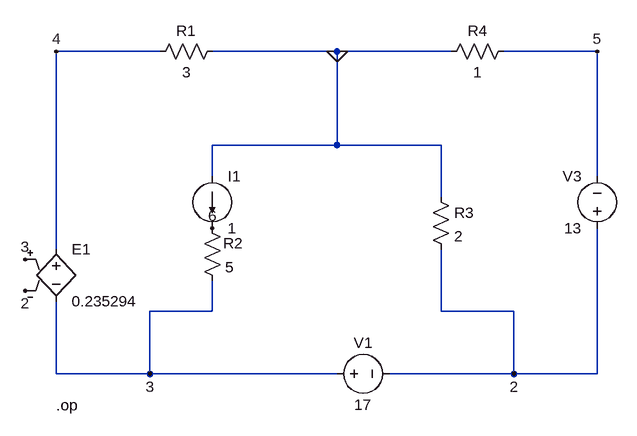
[diagram p0: schematic surse_comandate.asc]
surse_comandate.asc, the LTspice schematic file:
Version 4
SHEET 1 1016 680
WIRE -16 -176 -176 -176
WIRE 256 -176 64 -176
WIRE 432 -176 256 -176
WIRE 656 -176 512 -176
WIRE 256 -32 256 -176
WIRE 256 -32 64 -32
WIRE 416 -32 256 -32
WIRE 64 16 64 -32
WIRE 656 16 656 -176
WIRE 416 48 416 -32
WIRE -176 128 -176 -176
WIRE 64 224 64 176
WIRE 64 224 -32 224
WIRE 416 224 416 128
WIRE 528 224 416 224
WIRE -176 320 -176 208
WIRE -32 320 -32 224
WIRE -32 320 -176 320
WIRE 256 320 -32 320
WIRE 528 320 528 224
WIRE 528 320 336 320
WIRE 656 320 656 96
WIRE 656 320 528 320
FLAG -32 320 3
FLAG 528 320 2
FLAG 256 -176 0
FLAG -176 -176 4
FLAG 656 -176 5
FLAG 64 96 6
FLAG -224 144 3
FLAG -224 192 2
SYMBOL voltage 240 320 R270
WINDOW 0 32 56 VTop 2
WINDOW 3 -32 56 VBottom 2
SYMATTR InstName V1
SYMATTR Value 17
SYMBOL voltage 656 112 R180
WINDOW 0 24 96 Left 2
WINDOW 3 24 16 Left 2
SYMATTR InstName V3
SYMATTR Value 13
SYMBOL current 64 16 R0
SYMATTR InstName I1
SYMATTR Value 1
SYMBOL res 400 32 R0
SYMATTR InstName R3
SYMATTR Value 2
SYMBOL res 48 80 R0
WINDOW 0 33 39 Left 2
SYMATTR InstName R2
SYMATTR Value 5
SYMBOL res 528 -192 R90
WINDOW 0 0 56 VBottom 2
WINDOW 3 32 56 VTop 2
SYMATTR InstName R4
SYMATTR Value 1
SYMBOL res -32 -160 R270
WINDOW 0 32 56 VTop 2
WINDOW 3 0 56 VBottom 2
SYMATTR InstName R1
SYMATTR Value 3
SYMBOL e -176 112 R0
SYMATTR InstName E1
SYMATTR Value 0.235294
TEXT -176 368 Left 2 !.op

The netlist it stands for:
* surse_comandate.asc
V1 3 2 17
V3 2 5 13
I1 0 6 1
R3 0 2 2
R2 6 3 5
R4 5 0 1
R1 4 0 3
E1 4 3 3 2 0.235294
.op
.backanno
.end